# EAGLE schematic usb-power-switch (EAGLE 7.3.0)
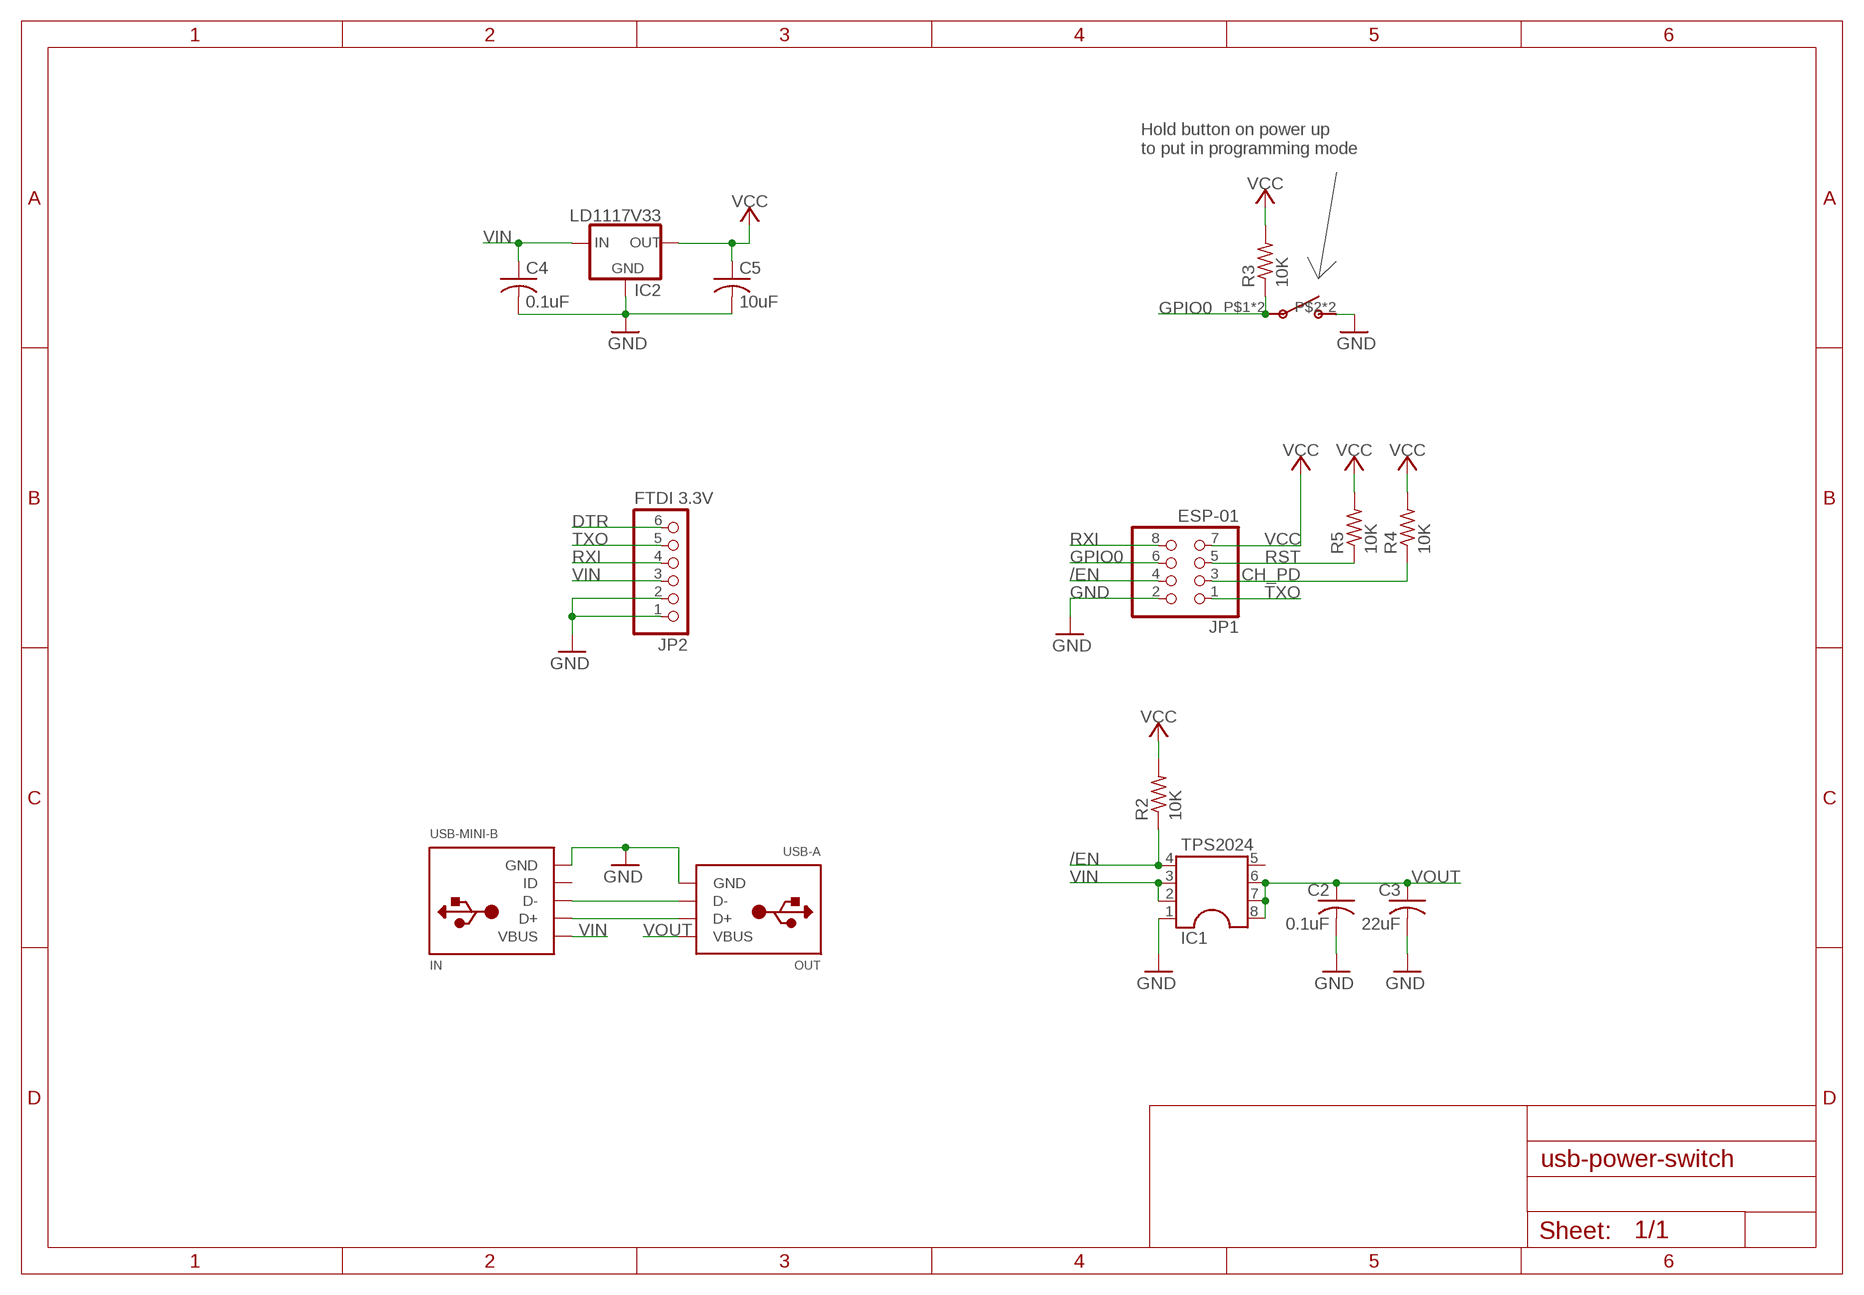
[diagram p0: schematic, sheet 1]

## Parts
C2  0.1uF  C-US025-025X050  [C025-025X050]
C3  22uF  C-US025-025X050  [C025-025X050]
C4  0.1uF  C-US025-025X050  [C025-025X050]
C5  10uF  C-US025-025X050  [C025-025X050]
IC1  TPS2024  DIL8  [DIL08]
IC2  LD1117V33  V_REG_LD1117VXX  [78XXL]
IN  USB-MINI-B  [USB-MINI-B]
JP1  ESP-01  PINHD-2X4  [2X04]
JP2  FTDI 3.3V  PINHD-1X6  [1X06]
OUT  USB-A  [USB-A]
R2  10K  R-US_0207/10  [0207/10]
R3  10K  R-US_0207/10  [0207/10]
R4  10K  R-US_0207/10  [0207/10]
R5  10K  R-US_0207/10  [0207/10]
S1  TACTILE-BUTTON-MJTP1230  [TACTILE-BUTTON-MJTP1230]

## Nets
/EN: IC1.4 JP1.4 R2.1
CH_PD: JP1.3 R4.1
D+: IN.D+ OUT.P$3(D+)
D-: IN.D- OUT.P$2(D-)
DTR: JP2.6
GND: C2.2 C3.2 C4.2 C5.2 IC1.1 IC2.IN(GND) IN.GND JP1.2 JP2.1 JP2.2 OUT.P$4(GND) S1.P$2 S1.P$4
GPIO0: JP1.6 R3.1 S1.P$1 S1.P$3
RST: JP1.5 R5.1
RXI: JP1.8 JP2.4
TXO: JP1.1 JP2.5
VCC: C5.1 IC2.GND(OUT) JP1.7 R2.2 R3.2 R4.2 R5.2
VIN: C4.1 IC1.2 IC1.3 IC2.OUT(IN) IN.VBUS JP2.3
VOUT: C2.1 C3.1 IC1.6 IC1.7 IC1.8 OUT.P$1(VBUS)
Unconnected: IC1.5 IN.ID

## Notes on the sheet
- Hold button on power up
  to put in programming mode

## Library data of the parts
C2-C5 = rcl:C-US: CAPACITOR, American symbol
IC1 = ic-package:DIL8: Dual In Line / Socket
IC2 = SparkFun-PowerIC:V_REG_LD1117VXX: LD1117VXX voltage regulator. We carry the 3.3V version (COM-00526) in TO-220 package.
IN = my-custom:USB-MINI-B: USB Connectors USBMINIB - Surface Mount Female Mini-B USB Connector 4UConnector: 06564 By microbuilder.eu Thru-hole RA Female Mini-B USB Connector 4UConnector: 18732 By ladyada.net
JP1 = pinhead:PINHD-2X4: PIN HEADER
JP2 = pinhead:PINHD-1X6: PIN HEADER
OUT = my-custom:USB-A: USB type A 'plug' Used for things that can directly connect to a USB port, say USB key
R2-R5 = rcl:R-US_: RESISTOR, American symbol
S1 = my-custom:TACTILE-BUTTON-MJTP1230